# Altium schematic sheet MacSet-L-V2.0.0_1.SchDoc
size A4; SheetNumber: 1; SheetTotal: 3
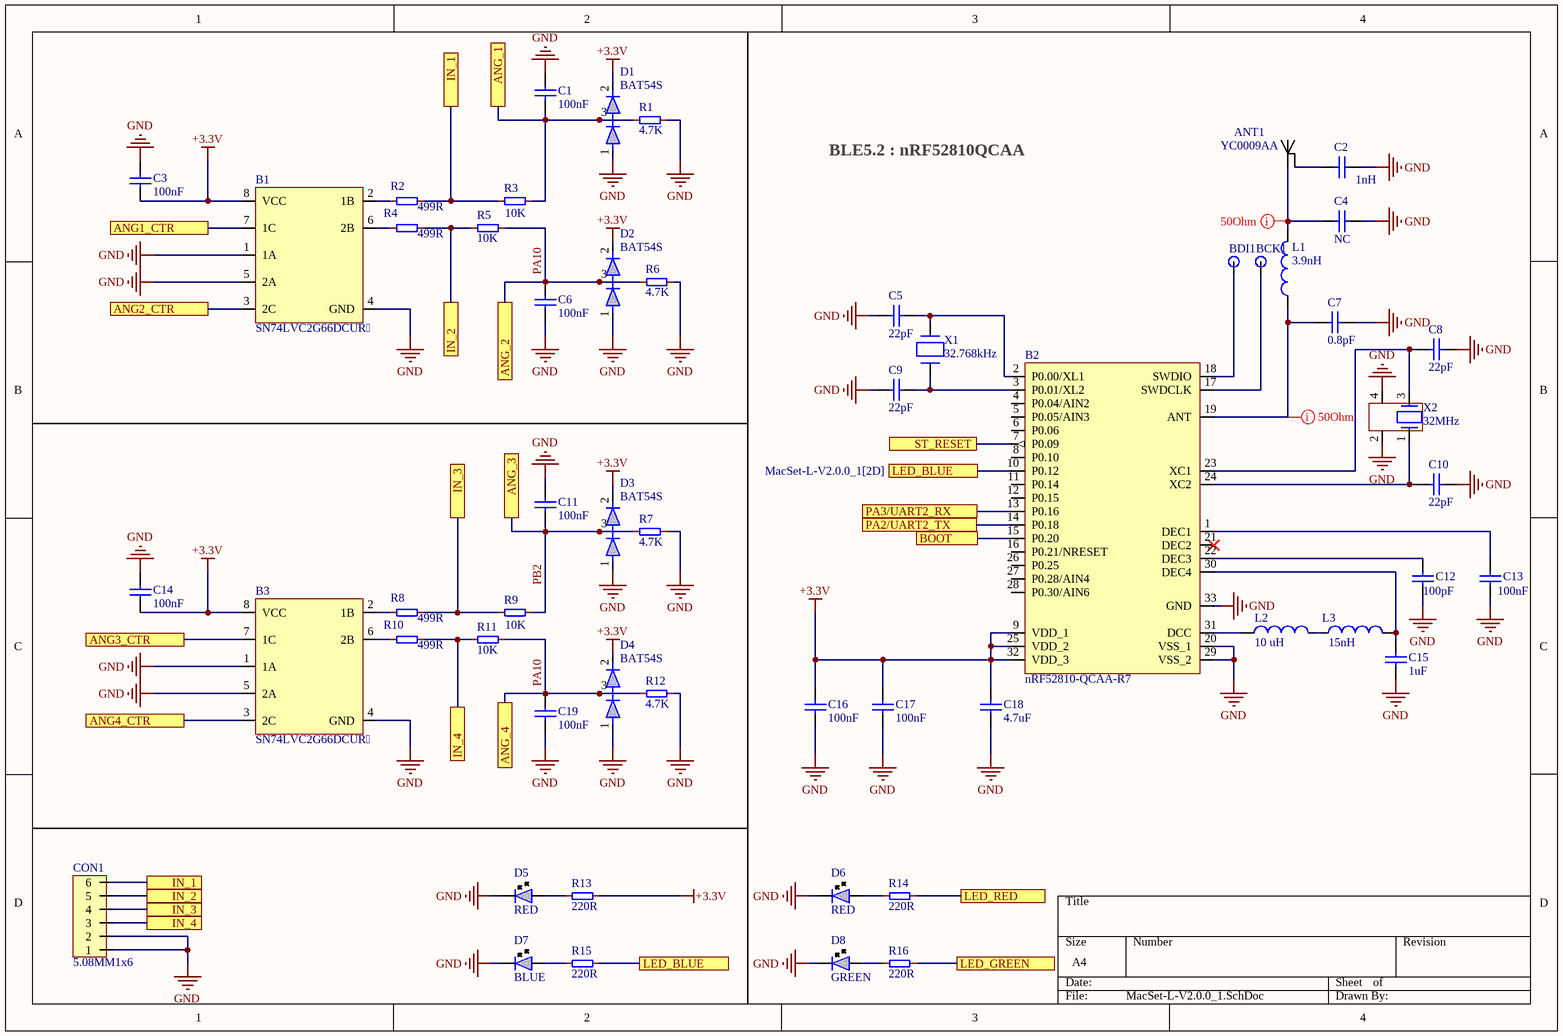
[diagram p0: MacSet-L-V2.0.0_1.SchDoc]

## Parts
ANT1  YC0009AA  [YC009AA]
B1  SN74LVC2G66DCUR  [SOP50P310X90-8N]
B2  nRF52810-QCAA-R7  [QFN50P500X500X95-33N]
B3  SN74LVC2G66DCUR  [SOP50P310X90-8N]
BCK1  -  [TH_Pad]  (value not drawn)  (net tie, no BOM)
BDI1  -  [TH_Pad]  (value not drawn)  (net tie, no BOM)
C1  100nF  [CAP0402]
C2  1nH  [CAP0402]  (net tie, no BOM)
C3  100nF  [CAP0402]
C4  NC  [CAP0402]  (net tie, no BOM)
C5  22pF  [CAP0402]
C6  100nF  [CAP0402]
C7  0.8pF  [CAP0402]
C8  22pF  [CAP0402]
C9  22pF  [CAP0402]
C10  22pF  [CAP0402]
C11  100nF  [CAP0402]
C12  100pF  [CAP0402]
C13  100nF  [CAP0402]
C14  100nF  [CAP0402]
C15  1uF  [CAP0603]
C16  100nF  [CAP0402]
C17  100nF  [CAP0402]
C18  4.7uF  [CAP0603]
C19  100nF  [CAP0402]
CON1  5.08MM1x6  [Screw Terminal Block 5.08x6]
D1  BAT54S  [SOT23]
D2  BAT54S  [SOT23]
D3  BAT54S  [SOT23]
D4  BAT54S  [SOT23]
D5  RED  [LED_3MM]
D6  RED  [LED_3MM]
D7  BLUE  [LED_3MM]
D8  GREEN  [LED_3MM]
L1  3.9nH  [IND_0402]
L2  value 10 uH  [IND_0603]  (hidden comment: 10uH)
L3  15nH  [IND_0402]
R1  4.7K  [RESC0402]
R2  499R  [RESC0805]
R3  10K  [RESC0402]
R4  499R  [RESC0805]
R5  10K  [RESC0402]
R6  4.7K  [RESC0402]
R7  4.7K  [RESC0402]
R8  499R  [RESC0805]
R9  10K  [RESC0402]
R10  499R  [RESC0805]
R11  10K  [RESC0402]
R12  4.7K  [RESC0402]
R13  220R  [RESC0402]
R14  220R  [RESC0402]
R15  220R  [RESC0402]
R16  220R  [RESC0402]
X1  32.768kHz  [OSC_3215]
X2  value 32MHz  [OSC_2016]  (hidden comment: OSC_2016)

## Ports
ANG1_CTR (see MacSet-L-V2.0.0_2[3A]), ANG2_CTR (see MacSet-L-V2.0.0_2[3A]), ANG3_CTR (see MacSet-L-V2.0.0_2[3A]), ANG4_CTR (see MacSet-L-V2.0.0_2[3A]), ANG_1 (see MacSet-L-V2.0.0_2[4A]), ANG_2 (see MacSet-L-V2.0.0_2[4A]), ANG_3 (see MacSet-L-V2.0.0_2[4A]), ANG_4 (see MacSet-L-V2.0.0_2[3A]), BOOT (see MacSet-L-V2.0.0_2[3A]), IN_1 (see MacSet-L-V2.0.0_1[1D]), IN_1 (see MacSet-L-V2.0.0_1[2A]), IN_2 (see MacSet-L-V2.0.0_1[1D]), IN_2 (see MacSet-L-V2.0.0_1[2B]), IN_3 (see MacSet-L-V2.0.0_1[1D]), IN_3 (see MacSet-L-V2.0.0_1[2C]), IN_4 (see MacSet-L-V2.0.0_1[1D]), IN_4 (see MacSet-L-V2.0.0_1[2C]), LED_BLUE (see MacSet-L-V2.0.0_1[2D]), LED_BLUE (see MacSet-L-V2.0.0_1[3B]), LED_GREEN (see MacSet-L-V2.0.0_2[4B]), LED_RED (see MacSet-L-V2.0.0_2[4A]), PA2/UART2_TX (see MacSet-L-V2.0.0_2[2D], MacSet-L-V2.0.0_2[3A]), PA3/UART2_RX (see MacSet-L-V2.0.0_2[2D], MacSet-L-V2.0.0_2[3A]), ST_RESET (see MacSet-L-V2.0.0_2[2A], MacSet-L-V2.0.0_2[3D])

## Nets
+3.3V: B1.8(VCC) B2.9(VDD_1) B2.25(VDD_2) B2.32(VDD_3) B3.8(VCC) C3.2 C14.2 C16.2 C17.2 C18.2 D1.2 D2.2 D3.2 D4.2 R13.1
GND: B1.1(1A) B1.4(GND) B1.5(2A) B2.20(VSS_1) B2.29(VSS_2) B2.33(GND) B3.1(1A) B3.4(GND) B3.5(2A) C1.2 C2.1 C3.1 C4.1 C5.1 C6.1 C7.1 C8.2 C9.1 C10.2 C11.2 C12.2 C13.2 C14.1 C15.1 C16.1 C17.1 C18.1 C19.1 CON1.1 CON1.2 D1.1 D2.1 D3.1 D4.1 D5.1(K) D6.1(K) D7.1(K) D8.1(K) R1.1 R6.1 R7.1 R12.1 X2.2 X2.4
ANG1_CTR: B1.7(1C) ; port ANG1_CTR
ANG2_CTR: B1.3(2C) ; port ANG2_CTR
ANG3_CTR: B3.7(1C) ; port ANG3_CTR
ANG4_CTR: B3.3(2C) ; port ANG4_CTR
ANG_1: C1.1 D1.3 R1.2 R3.1 ; port ANG_1
BOOT: B2.15(P0.20) ; port BOOT
IN_1: CON1.6 R2.2 R3.2 ; port IN_1
IN_2: CON1.5 R4.2 R5.2 ; port IN_2
IN_3: CON1.4 R8.2 R9.2 ; port IN_3
IN_4: CON1.3 R10.2 R11.2 ; port IN_4
LED_BLUE: B2.10(P0.12) R15.1 ; port LED_BLUE
LED_GREEN: R16.1 ; port LED_GREEN
LED_RED: R14.1 ; port LED_RED
PA2/UART2_TX: B2.14(P0.18) ; port PA2/UART2_TX
PA3/UART2_RX: B2.13(P0.16) ; port PA3/UART2_RX
PA10: C6.2 C19.2 D2.3 D4.3 R5.1 R6.2 R11.1 R12.2 ; port ANG_2, port ANG_4
PB2: C11.1 D3.3 R7.2 R9.1 ; port ANG_3
ST_RESET: B2.7(P0.09) ; port ST_RESET
NetANT1_1: ANT1.1 C4.2 L1.2
NetANT1_2: ANT1.2 C2.2
NetB1_2: B1.2(1B) R2.1
NetB1_6: B1.6(2B) R4.1
NetB2_1: B2.1(DEC1) C13.1
NetB2_2: B2.2(P0.00/XL1) C5.2 X1.2(X2)
NetB2_3: B2.3(P0.01/XL2) C9.2 X1.1(X1)
NetB2_17: B2.17(SWDCLK) BCK1.1
NetB2_18: B2.18(SWDIO) BDI1.1
NetB2_19: B2.19(ANT) C7.2 L1.1
NetB2_22: B2.22(DEC3) C12.1
NetB2_23: B2.23(XC1) C8.1 X2.3
NetB2_24: B2.24(XC2) C10.1 X2.1
NetB2_30: B2.30(DEC4) C15.2 L3.2
NetB2_31: B2.31(DCC) L2.1
NetB3_2: B3.2(1B) R8.1
NetB3_6: B3.6(2B) R10.1
NetD5_2: D5.2(A) R13.2
NetD6_2: D6.2(A) R14.2
NetD7_2: D7.2(A) R15.2
NetD8_2: D8.2(A) R16.2
NetL2_2: L2.2 L3.1

Not connected (* = marked no-connect by the designer): B2 4(P0.04/AIN2) 5(P0.05/AIN3) 6(P0.06) 8(P0.10) 11(P0.14) 12(P0.15) 16(P0.21/NRESET) 21(DEC2)* 26(P0.25) 27(P0.28/AIN4) 28(P0.30/AIN6)

## Layout directives
net class 50Ohm; rule Width Constraint [Pref Width = 0.254mm    Min Width = 0.254mm    Max Width = 0.254mm]: NetANT1_1, NetB2_19

## Notes on the sheet
- BLE5.2 : nRF52810QCAA

## Library data of the parts
ANT1 = YC0009AA: Antennas Embedded, 2400-2500 MHz, Wi-Fi (Bluetooth), Ceramic, -, -, SMD, 3.2 YCA009AA; Manufacturer: Quectel; Manufacturer_Part_Number: YC0009AA
B1 B3 = SN74LVC2G66DCUR: 2-Channel, 1:1 Analog Switch with Low On-State Resistance; Manufacturer: Texas Instruments; Manufacturer_Part_Number: SN74LVC2G66DCUR
B2 = nRF52810-QCAA-R7: NORDIC SEMICONDUCTOR - NRF52810-QCAA-R7 - RF Transceiver, 2.36GHz to 2.5GHz, FSK, 2Mbps, 4dBm out, -89dBm in, 1.7V to 3.6V, QFN-32; Manufacturer: Nordic Semiconductor; Manufacturer_Part_Number: nRF52810-QCAA-R7
BCK1 BDI1 = TH_PAD: Through Hole pad 1mm 0.5mm Hole
C1 C3 C6 C11 C14 C19 = Capa_0402: Ceramic Capacitor C0G, NP0 0402 100nF 35V; Manufacturer_Part_Number: GRM155R61A104KA01J; Manufacturer: MURATA
C2 = Capa_0402: Multilayer Ceramic Capacitors MLCC - SMD/SMT 50 V 22pF C0G 0402 5%; Manufacturer_Part_Number: LQG15HS1N0B02D; Manufacturer: Murata
C4 = Capa_0402
C5 C8-C10 = Capa_0402: Multilayer Ceramic Capacitors MLCC - SMD/SMT 50 V 22pF C0G 0402 5%; Manufacturer_Part_Number: GCM1555C1H220JA16D; Manufacturer: Murata
C7 = Capa_0402: Ceramic Capacitor C0G, NP0 0402 0.8pF 50V; Manufacturer_Part_Number: CC0402BRNPO9BNR80; Manufacturer: YAGEO
C12 = Capa_0402: Ceramic Capacitor C0G, NP0 0402 100pF 50V; Manufacturer_Part_Number: GRM1555C1H101GA01D; Manufacturer: MURATA
C13 C16 C17 = Capa_0402: Ceramic Capacitor X7R 0402 100nF 16V; Manufacturer_Part_Number: GRM155R71C104JA88D; Manufacturer: MURATA
C15 = Capa_0603: MLCC - SMD/SMT 1 uF 16 VDC 10% 0603 X5R; Manufacturer_Part_Number: GRM188R61C105MA12D; Manufacturer: MURATA
C18 = Capa_0603: MLCC - SMD/SMT 4.7 uF 16 VDC 10% 0603 X5R; Manufacturer_Part_Number: CL10A475KQ8NNNC; Manufacturer: Samsung Electro-Mechanics
CON1 = Screw Terminal Block 6x1 5.08mm: 5.08mm 1*6 Screw Terminal Block; Manufacturer: XINYA; Manufacturer_Part_Number: *; Supplier: ROBU; Price: *; Package: 1x6x3.5
D1-D4 = BAT54SWT1G: BAT54S Schottky Diodes & Rectifiers SS SHKY DIO 30V TR; Manufacturer_Part_Number: Nexperia; Manufacturer: BAT54S,235
D5 D6 = LED_3MM: LED 3MM Through Hole RED; Manufacturer_Part_Number: *; Manufacturer: *; Supplier: *; Price: *; Package: 0603
D7 = LED_3MM: LED 3MM Through Hole BLUE; Manufacturer_Part_Number: *; Manufacturer: *; Supplier: *; Price: *; Package: 0603
D8 = LED_3MM: LED 3MM Through Hole GREEN; Manufacturer_Part_Number: *; Manufacturer: *; Supplier: *; Price: *; Package: 0603
L1 = Inductor: 3.9nH High frequency chip inductor ±5%  0402; Manufacturer_Part_Number: LQG15HS3N9B02D; Manufacturer: Murata
L2 = MCD-01330: 250mA 10uH ±20% 90mΩ 0603 Inductors; Manufacturer_Part_Number: MLZ1608M100WT000; Manufacturer: TDK
L3 = MCD-01330: 400mA 15nH ±5% 350mΩ 0402 Inductors; Manufacturer_Part_Number: MLG1005S15NJT000; Manufacturer: Murata; Value: 15nH
R1 R6 R7 R12 = RES_0402: Thin Film Resistors - SMD 4.7Kohms 0.1% 0402 25ppm; Manufacturer_Part_Number: RT0402BRD074K7L; Manufacturer: YAGEO; Parameter 1: *
R2 R4 R8 R10 = RES_0805: Thin Film Resistors - SMD 499ohms 0.1% 25ppm; Manufacturer_Part_Number: TNPW0805499RBEEA; Manufacturer: Vishay; Parameter 1: *
R3 R5 R9 R11 = RES_0402: Thick Film Resistors - SMD 1/16watt 10Kohms 0.1% 0402 Commercial Use; Manufacturer_Part_Number: MCS04020D1002BE000; Manufacturer: Vishay; Parameter 1: *
R13-R16 = RES_0402: Thick Film Resistors - SMD 1/16watt 220R 0402 1% Commercial Use; Manufacturer_Part_Number: RC0402FR-07220RL; Manufacturer: Vishay; Parameter 1: *
X1 = OSC_2012: Crystal Osc 3215 32.768kHz 12pF; Manufacturer_Part_Number: ECS-.327-12.5-34B-TR; Manufacturer: ECS; Value: 32.768kHz
X2 = OSC_2016: Crystal Osc 2016 32MHz 12pF  60R; Manufacturer_Part_Number: XRCGB32M000F1SADR0; Manufacturer: Murata